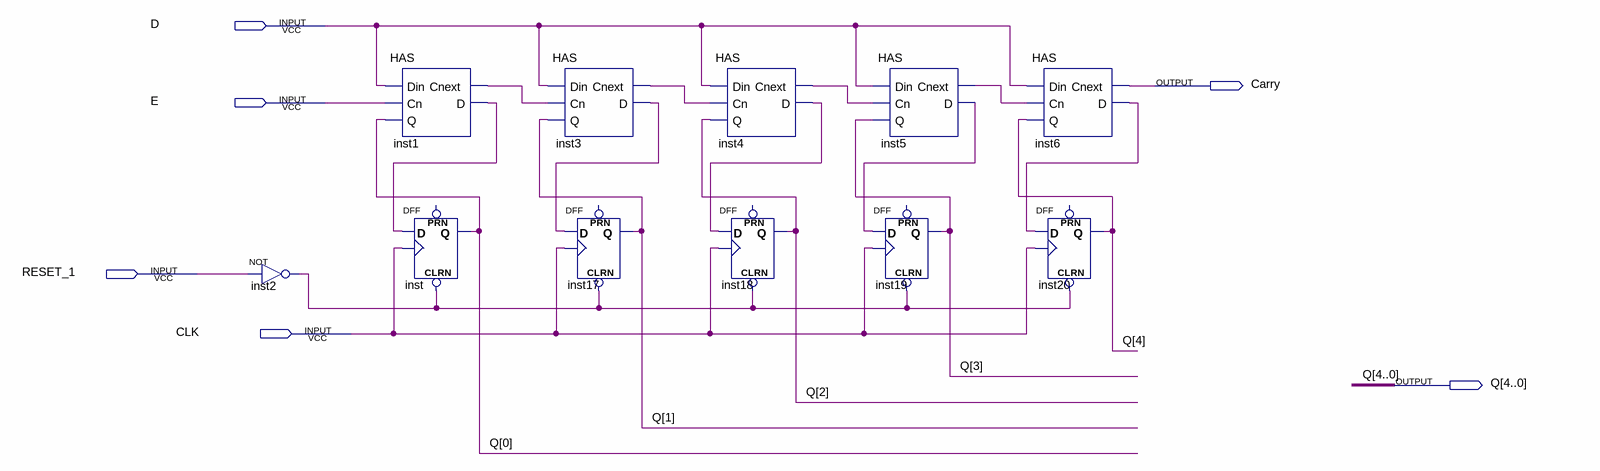
[diagram p0: schematic sheet]
// Quartus schematic Counter.bdf as structural Verilog: 11 symbols, 6 pins
module Counter (
  input  D,
  input  E,
  input  RESET_1,
  input  CLK,
  output Carry,
  output [4:0] Q
);

  wire inst1_cnext, inst1_d, inst2_out, inst3_cnext, inst3_d, inst4_cnext, inst4_d, inst5_cnext, inst5_d,
       inst6_d;

  not inst2 (inst2_out, RESET_1);
  HAS inst1 (.Din(D), .Cn(E), .Q(Q[0]), .Cnext(inst1_cnext), .D(inst1_d));
  DFF inst (.CLRN(inst2_out), .CLK(CLK), .D(inst1_d), .Q(Q[0]));  // open: PRN
  HAS inst3 (.Din(D), .Cn(inst1_cnext), .Q(Q[1]), .Cnext(inst3_cnext), .D(inst3_d));
  DFF inst17 (.CLRN(inst2_out), .CLK(CLK), .D(inst3_d), .Q(Q[1]));  // open: PRN
  HAS inst4 (.Din(D), .Cn(inst3_cnext), .Q(Q[2]), .Cnext(inst4_cnext), .D(inst4_d));
  DFF inst18 (.CLRN(inst2_out), .CLK(CLK), .D(inst4_d), .Q(Q[2]));  // open: PRN
  HAS inst5 (.Din(D), .Cn(inst4_cnext), .Q(Q[3]), .Cnext(inst5_cnext), .D(inst5_d));
  DFF inst19 (.CLRN(inst2_out), .CLK(CLK), .D(inst5_d), .Q(Q[3]));  // open: PRN
  HAS inst6 (.Din(D), .Cn(inst5_cnext), .Q(Q[4]), .Cnext(Carry), .D(inst6_d));
  DFF inst20 (.CLRN(inst2_out), .CLK(CLK), .D(inst6_d), .Q(Q[4]));  // open: PRN
endmodule
